# Altium schematic sheet Sensors.SchDoc
size A; SheetNumber: 4; SheetTotal: 6
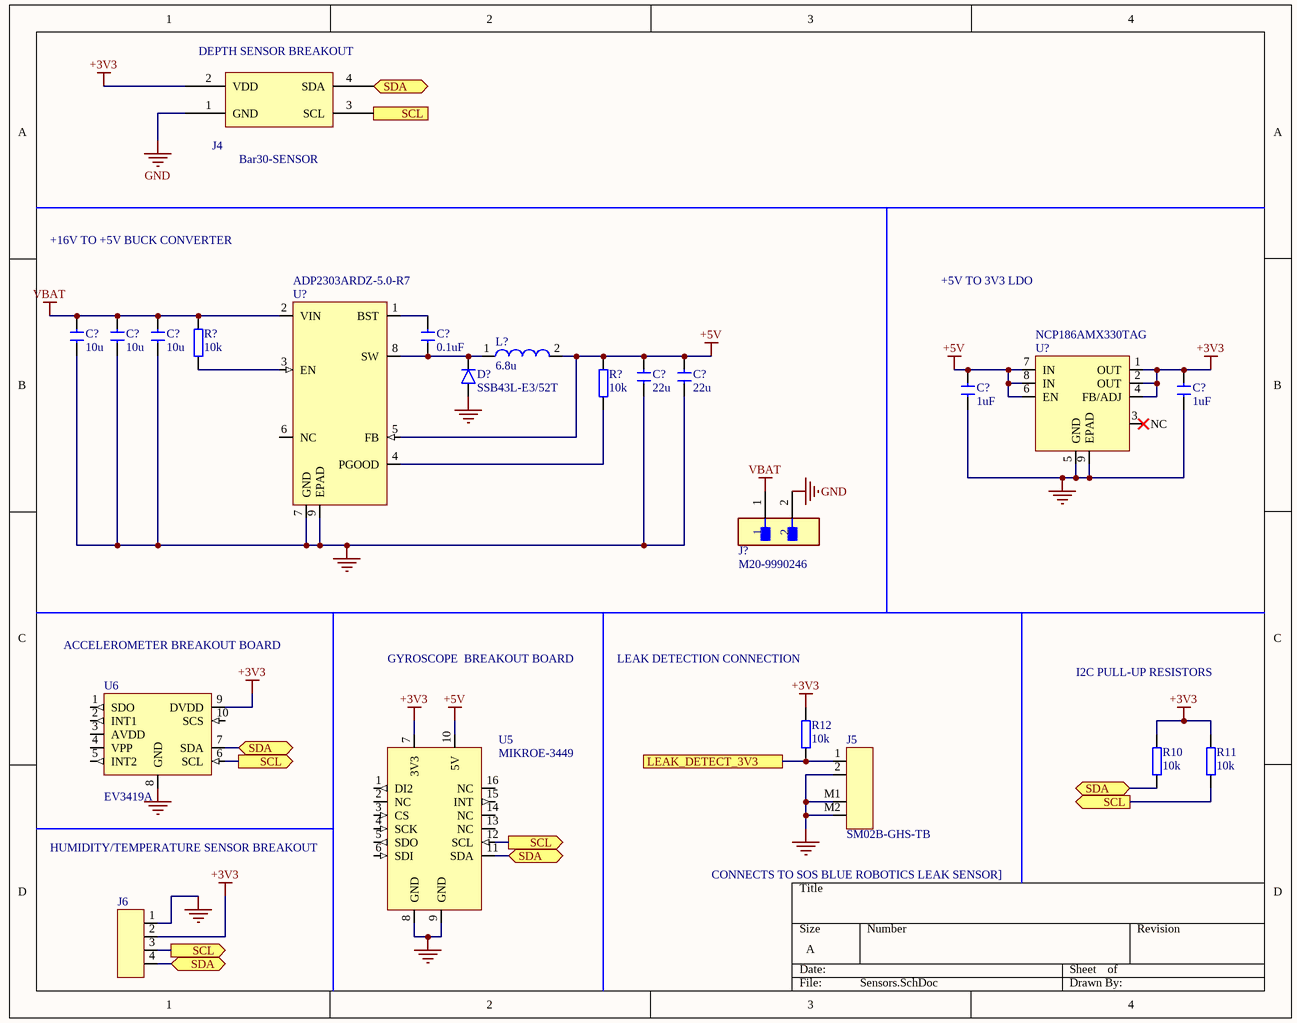
[diagram p0: Sensors.SchDoc]

## Parts
(Parts that share a designator on the sheet are numbered #1, #2 ... from top to bottom, then left to right.)
C?#1  10u  [1206 Capacitor]
C?#2  10u  [1206 Capacitor]
C?#3  10u  [1206 Capacitor]
C?#4  0.1uF  [0603 Capacitor]
C?#5  22u  [0805 Capacitor]
C?#6  22u  [0805 Capacitor]
C?#7  1uF  [0603 Capacitor]
C?#8  1uF  [0603 Capacitor]
D?  SSB43L-E3/52T  [DO-214AA]
J4  Bar30-SENSOR
J5  SM02B-GHS-TB  [SM02B-GHS-TB]
J6  PPTC041LFBN-RC  [HDR 4POS 2.54mm]  (value not drawn)
J?  M20-9990246  [FP-M20-9990246-MFG]
L?  6.8u  [CLF10060NIT-6R8N-D 10.10mm x 10.00mm]
R10  10k  [0603 Resistor]
R11  10k  [0603 Resistor]
R12  10k  [0603 Resistor]
R?#1  10k  [0603 Resistor]
R?#2  10k  [0603 Resistor]
U5  MIKROE-3449  [MIKROE-3449]
U6  EV3419A  [EV3419A]
U?#1  ADP2303ARDZ-5.0-R7  [SOIC-8-EP]
U?#2  NCP186AMX330TAG  [8-XFDFN Exposed Pad]

## Ports
LEAK_DETECT_3V3 (see Microcontroller[3E], Microcontroller[9B]), SCL (out, see Microcontroller[1D], Microcontroller[2E], Microcontroller[4D], Microcontroller[5D], Microcontroller[5E], Microcontroller[9E], Sensors[1C], Sensors[1D], Sensors[2A], Sensors[2D]), SCL (out, see Microcontroller[1D], Microcontroller[2E], Microcontroller[4D], Microcontroller[5D], Microcontroller[5E], Microcontroller[9E], Sensors[1C], Sensors[1D], Sensors[2A], Sensors[4D]), SCL (out, see Microcontroller[1D], Microcontroller[2E], Microcontroller[4D], Microcontroller[5D], Microcontroller[5E], Microcontroller[9E], Sensors[1C], Sensors[1D], Sensors[2D], Sensors[4D]), SCL (out, see Microcontroller[1D], Microcontroller[2E], Microcontroller[4D], Microcontroller[5D], Microcontroller[5E], Microcontroller[9E], Sensors[1C], Sensors[2A], Sensors[2D], Sensors[4D]), SCL (out, see Microcontroller[1D], Microcontroller[2E], Microcontroller[4D], Microcontroller[5D], Microcontroller[5E], Microcontroller[9E], Sensors[1D], Sensors[2A], Sensors[2D], Sensors[4D]), SDA (bidir, see Microcontroller[1D], Microcontroller[2E], Microcontroller[4D], Microcontroller[5D], Microcontroller[5E], Microcontroller[9E], Sensors[1C], Sensors[1D], Sensors[2A], Sensors[2D]), SDA (bidir, see Microcontroller[1D], Microcontroller[2E], Microcontroller[4D], Microcontroller[5D], Microcontroller[5E], Microcontroller[9E], Sensors[1C], Sensors[1D], Sensors[2A], Sensors[4D]), SDA (bidir, see Microcontroller[1D], Microcontroller[2E], Microcontroller[4D], Microcontroller[5D], Microcontroller[5E], Microcontroller[9E], Sensors[1C], Sensors[1D], Sensors[2D], Sensors[4D]), SDA (bidir, see Microcontroller[1D], Microcontroller[2E], Microcontroller[4D], Microcontroller[5D], Microcontroller[5E], Microcontroller[9E], Sensors[1C], Sensors[2A], Sensors[2D], Sensors[4D]), SDA (bidir, see Microcontroller[1D], Microcontroller[2E], Microcontroller[4D], Microcontroller[5D], Microcontroller[5E], Microcontroller[9E], Sensors[1D], Sensors[2A], Sensors[2D], Sensors[4D])

## Nets
+3V3: C?#8.1 J4.2(VDD) J6.2 R10.2 R11.2 R12.2 U5.7(3V3) U6.9(DVDD) U?#2.1(OUT) U?#2.2(OUT) U?#2.4(FB/ADJ)
+5V: C?#5.1 C?#6.1 C?#7.1 L?.2 R?#2.1 U5.10(5V) U?#1.5(FB) U?#2.6(EN) U?#2.7(IN) U?#2.8(IN)
GND: C?#1.1 C?#2.1 C?#3.1 C?#5.2 C?#6.2 C?#7.2 C?#8.2 D?.A J4.1(GND) J5.2 J5.M1 J5.M2 J6.1 J?.2 U5.8(GND) U5.9(GND) U6.8(GND) U?#1.7(GND) U?#1.9(EPAD) U?#2.5(GND) U?#2.9(EPAD)
VBAT: C?#1.2 C?#2.2 C?#3.2 J?.1 R?#1.1 U?#1.2(VIN)
LEAK_DETECT_3V3: J5.1 R12.1 ; port LEAK_DETECT_3V3
SCL: J4.3(SCL) J6.3 R11.1 U5.12(SCL) U6.6(SCL) ; port SCL
SDA: J4.4(SDA) J6.4 R10.1 U5.11(SDA) U6.7(SDA) ; port SDA
NetC?#4_1: C?#4.1 D?.C L?.1 U?#1.8(SW)
NetC?#4_2: C?#4.2 U?#1.1(BST)
NetR?#1_2: R?#1.2 U?#1.3(EN)
NetR?#2_2: R?#2.2 U?#1.4(PGOOD)

Not connected (* = marked no-connect by the designer): U5 1(DI2) 2(NC) 3(CS) 4(SCK) 5(SDO) 6(SDI) 13(NC) 14(NC) 15(INT) 16(NC); U6 1(SDO) 2(INT1) 3(AVDD) 4(VPP) 5(INT2) 10(SCS); U?#1 6(NC); U?#2 3(NC)

## Notes on the sheet
- (near J4) DEPTH SENSOR BREAKOUT
- +16V TO +5V BUCK CONVERTER
- +5V TO 3V3 LDO
- ACCELEROMETER BREAKOUT BOARD
- GYROSCOPE  BREAKOUT BOARD
- LEAK DETECTION CONNECTION
- I2C PULL-UP RESISTORS
- HUMIDITY/TEMPERATURE SENSOR BREAKOUT
- CONNECTS TO SOS BLUE ROBOTICS LEAK SENSOR]

## Library data of the parts
C?#1-C?#3 = GRM31CR71E106MA12L: CAP CER 10UF 25V X7R 1206; Manufacturer: Murata; Material: 4241ConductorMaterial; Tolerance: 20%; Supplier: Digi-Key; Supplier Part Number: 490-6519-1-ND; Manufacturer Part Number: GRM31CR71E106MA12L; RoHS: Yes; Category: Ceramic Capacitors; Stock: 74067; Pricing: 1=0.29, 10=0.199, 50=0.1396, 100=0.1196, 500=0.08972, 1000=0.07576 (USD); Mounting Technology: Surface Mount; Case/Package: 1206; Case Code (Metric): 3216; Case Code (Imperial): 1206; Min Operating Temperature: -55°C; Max Operating Temperature: 125°C; Value: 10uF; Dielectric: X7R; Package Quantity: 1; Voltage Rating: 25V; Packaging: Tape and Reel; Termination: SMD/SMT; Voltage: 25V; Voltage Rating (DC): 25V; Series: GRM; Construction: Flat; Length: 3.2mm; Width: 0.063inch; Height: 1.6mm; Thickness: 0.071inch; Depth: 1.6mm; Radiation Hardening: No; Reach SVHC Compliant: No; Lead Free: Lead Free; RoHS Compliant: Yes; ComponentLink1URL: https://datasheet.ciiva.com/11607/product-11607561.pdf?src-supplier=Avnet; ComponentLink1Description: https://datasheet.ciiva.com/11607/product-11607561.pdf?src-supplier=Avnet; ComponentLink2URL: https://datasheet.ciiva.com/5412/product-5412861.pdf?src-supplier=Mouser; ComponentLink2Description: https://datasheet.ciiva.com/5412/product-5412861.pdf?src-supplier=Mouser; ComponentLink3URL: https://datasheet.ciiva.com/6264/partnumbering-e-01-6264463.pdf?src-supplier=Digi-Key; ComponentLink3Description: https://datasheet.ciiva.com/6264/partnumbering-e-01-6264463.pdf?src-supplier=Digi-Key
C?#4 = CC0603KRX7R9BB104: CAP CER 0.1UF 50V X7R 0603; Manufacturer: Yageo; Dielectric Material: Ceramic; Value: 100nF; Tolerance: 10%; Supplier: Digi-Key; Supplier Part Number: 311-1344-1-ND; Manufacturer Part Number: CC0603KRX7R9BB104; RoHS: Yes; Category: Ceramic Capacitors; Stock: 4893723; Pricing: 1=0.1, 10=0.054, 50=0.0296, 100=0.0243, 500=0.01732, 1000=0.01361 (USD); Mounting Technology: Surface Mount; Case/Package: 0603; Pins: 2; Case Code (Metric): 1608; Case Code (Imperial): 0603; Min Operating Temperature: -55°C; Max Operating Temperature: 125°C; Package Quantity: 1; Voltage Rating: 50V; Packaging: Tape and Reel; Dielectric: X7R; Termination: SMD/SMT; Voltage: 50V; Series: CC; Length: 0.063inch; Width: 0.031inch; Height: 0.8mm; Thickness: 0.035inch; Depth: 0.8mm; Radiation Hardening: No; Reach SVHC Compliant: No; Lead Free: Lead Free; Halogen Free: Halogen Free; RoHS Compliant: Yes; ComponentLink1URL: https://datasheet.ciiva.com/11786/0900766b80d84f1d-11786061.pdf?src-supplier=Rs; ComponentLink1Description: https://datasheet.ciiva.com/11786/0900766b80d84f1d-11786061.pdf?src-supplier=Rs; ComponentLink2URL: https://datasheet.ciiva.com/8033/70765-8033819.pdf?src-supplier=Element14; ComponentLink2Description: https://datasheet.ciiva.com/8033/70765-8033819.pdf?src-supplier=Element14; ComponentLink3URL: https://datasheet.ciiva.com/8033/70765-8033821.pdf?src-supplier=Element14; ComponentLink3Description: https://datasheet.ciiva.com/8033/70765-8033821.pdf?src-supplier=Element14; ComponentLink4URL: https://datasheet.ciiva.com/7978/1489800-7978166.pdf?src-supplier=Element14; ComponentLink4Description: https://datasheet.ciiva.com/7978/1489800-7978166.pdf?src-supplier=Element14; ComponentLink5URL: https://datasheet.ciiva.com/31394/1489800-31394927.pdf?src-supplier=Farnell; ComponentLink5Description: https://datasheet.ciiva.com/31394/1489800-31394927.pdf?src-supplier=Farnell; ComponentLink6URL: https://datasheet.ciiva.com/22749/1489800-22749214.pdf?src-supplier=Element14; ComponentLink6Description: https://datasheet.ciiva.com/22749/1489800-22749214.pdf?src-supplier=Element14; ComponentLink7URL: https://datasheet.ciiva.com/144/mlccorderingcode-144177.pdf?src-supplier=Digi-Key; ComponentLink7Description: https://datasheet.ciiva.com/144/mlccorderingcode-144177.pdf?src-supplier=Digi-Key; ComponentLink8URL: https://datasheet.ciiva.com/144/mlccorderingcode-144176.pdf?src-supplier=Digi-Key; ComponentLink8Description: https://datasheet.ciiva.com/144/mlccorderingcode-144176.pdf?src-supplier=Digi-Key; ComponentLink9URL: https://datasheet.ciiva.com/144/mlccorderingcode-144178.pdf?src-supplier=Digi-Key; ComponentLink9Description: https://datasheet.ciiva.com/144/mlccorderingcode-144178.pdf?src-supplier=Digi-Key
C?#5 C?#6 = GRM21BZ71A226ME15L: CAP CER 22UF 10V X7R 0805; Manufacturer: Murata; Supplier: Digi-Key; Supplier Part Number: 490-GRM21BZ71A226ME15LCT-ND; Manufacturer Part Number: GRM21BZ71A226ME15L; RoHS: Yes; Category: Ceramic Capacitors; Stock: 55376; Pricing: 1=0.35, 10=0.241, 50=0.1688, 100=0.1447, 500=0.10852, 1000=0.09164 (USD); RoHS Compliant: Yes; ComponentLink1URL: https://datasheet.octopart.com/GRM21BZ71A226ME15L-Murata-datasheet-165579666.pdf?src-supplier=TME; ComponentLink1Description: https://datasheet.octopart.com/GRM21BZ71A226ME15L-Murata-datasheet-165579666.pdf?src-supplier=TME
C?#7 C?#8 = CL10A105KB8NNNC: CAP CER 1UF 50V X5R 0603; Manufacturer: Samsung; Tolerance: 10%; Supplier: Digi-Key; Supplier Part Number: 1276-1860-1-ND; Manufacturer Part Number: CL10A105KB8NNNC; RoHS: Yes; Category: Ceramic Capacitors; Stock: 3695273; Pricing: 1=0.14, 10=0.098, 50=0.0558, 100=0.0462, 500=0.03238, 1000=0.0268 (USD); Mounting Technology: Surface Mount; Case/Package: 0603; Case Code (Metric): 1608; Case Code (Imperial): 0603; Min Operating Temperature: -55°C; Max Operating Temperature: 85°C; Packaging: Tape and Reel; Value: 1uF; Voltage Rating: 50V; Dielectric: X5R; Series: CL; Length: 1.6mm; Depth: 0.8mm; Radiation Hardening: No; RoHS Compliant: Yes; ComponentLink1URL: https://datasheet.ciiva.com/26877/getdatasheetpartid-753736-26877879.pdf?src-supplier=Verical; ComponentLink1Description: https://datasheet.ciiva.com/26877/getdatasheetpartid-753736-26877879.pdf?src-supplier=Verical
D? = SSB43L-E3/52T: DIODE SCHOTTKY 30V 4A DO214AA; Manufacturer: Vishay Semiconductors; Max Surge Current: 100A; Forward Voltage: 450mV; Max Reverse Current: 600uA; Polarity: Standard; Supplier: Digi-Key; Supplier Part Number: SSB43L-E3/52TGICT-ND; Manufacturer Part Number: SSB43L-E3/52T; RoHS: Yes; Category: Rectifier Diodes; Stock: 42896; Pricing: 1=0.56, 10=0.482, 100=0.3351 (USD); Mounting Technology: Surface Mount; Case/Package: DO-214AA; Pins: 2; Min Operating Temperature: -65°C; Max Operating Temperature: 150°C; Packaging: Tape and Reel; Forward Current: 4A; Package Quantity: 1; Max Reverse Leakage Current: 600uA; Average Rectified Current: 4A; Peak Non-Repetitive Surge Current: 100A; Max Repetitive Reverse Voltage (Vrrm): 30V; Max Forward Surge Current (Ifsm): 100A; Voltage Rating (DC): 30V; Current Rating: 4A; Output Current: 4A; Max Reverse Voltage (DC): 30V; Length: 4.7mm; Width: 3.8mm; Height: 0.095inch; Radiation Hardening: No; Lead Free: Lead Free; RoHS Compliant: Yes; Reach SVHC Compliant: Unknown; ComponentLink1URL: https://datasheet.ciiva.com/14634/0900766b80dd0508-14634162.pdf?src-supplier=Allied+Electronics; ComponentLink1Description: https://datasheet.ciiva.com/14634/0900766b80dd0508-14634162.pdf?src-supplier=Allied+Electronics; ComponentLink2URL: https://datasheet.ciiva.com/4245/ssb43l-4245635.pdf?src-supplier=Arrow+Electronics; ComponentLink2Description: https://datasheet.ciiva.com/4245/ssb43l-4245635.pdf?src-supplier=Arrow+Electronics; ComponentLink3URL: https://datasheet.ciiva.com/18434/70217334-18434422.pdf?src-supplier=Allied+Electronics; ComponentLink3Description: https://datasheet.ciiva.com/18434/70217334-18434422.pdf?src-supplier=Allied+Electronics
J5 = SM02B-GHS-TB: CONN HDR PIN; Manufacturer: JST; Supplier: Digikey; Supplier Part Number: 455-1564-1-ND; Manufacturer Part Number: SM02B-GHS-TB; RoHS: No; Stock: 9689; Pricing: 1=0.46, 10=0.39, 100=0.303, 500=0.2597, 1000=0.21642 (USD)
J6 = PPTC041LFBN-RC: CONN HDR 4POS 0.1 TIN PCB; Manufacturer: Sullins; Number of Positions: 4; Connector Type: Header; Voltage Rating: 250V; Pitch: 2.54mm; Supplier: Digikey; Supplier Part Number: S7002-ND; Manufacturer Part Number: PPTC041LFBN-RC; RoHS: Yes; Category: Connectors; Stock: 28323; Pricing: 1=0.46, 10=0.399, 100=0.3286, 500=0.28574, 1000=0.23574, 5000=0.20716, 10000=0.2041 (USD); Mounting Technology: Through Hole; Contact Material: Bronze; Housing Material: Plastic; Contact Finish - Mating: TIN; Insulation Color: Black; Insulation Material: Polyester; Contact Shape: Square; Min Operating Temperature: -40°C; Max Operating Temperature: 105°C; Number of Rows: 1; Packaging: Tray; Termination: Solder; Contact Type: Female Socket; Fastening Type: Pull; Series: -; Length: 10.7mm; Width: 2.5mm; Height: 8.5mm; Lead Free: Lead Free; RoHS Compliant: Yes; Flammability Rating: UL94 V-0; ComponentLink1URL: https://media.digikey.com/pdf/Data%20Sheets/Sullins%20PDFs/Female_Headers.100_DS.pdf?src-supplier=Digikey; ComponentLink1Description: https://media.digikey.com/pdf/Data%20Sheets/Sullins%20PDFs/Female_Headers.100_DS.pdf?src-supplier=Digikey; ComponentLink2URL: http://www.sullinscorp.com/catalogs/78_Page80-81_HEADER_.100_2.54mm_FEMALE.pdf?src-supplier=Future+Electronics; ComponentLink2Description: http://www.sullinscorp.com/catalogs/78_Page80-81_HEADER_.100_2.54mm_FEMALE.pdf?src-supplier=Future+Electronics; ComponentLink3URL: https://datasheet.octopart.com/PPTC041LFBN-RC-Sullins-datasheet-41308905.pdf?src-supplier=Future+Electronics; ComponentLink3Description: https://datasheet.octopart.com/PPTC041LFBN-RC-Sullins-datasheet-41308905.pdf?src-supplier=Future+Electronics
J? = CMP-15831-000009-1: CONN HEADER VERT 2POS 2.54MM; Manufacturer: Harwin; Conn Gender: Male; Conn Orientation: Vertical; Number Of Contacts: 2; Current Rating: 3A; ComponentLink2URL: https://cdn.harwin.com/pdfs/M20-999.pdf; ComponentLink2Description: Datasheet; Package: M20-9990246; Temperature: -40°C to +105°C; Octopart: https://octopart.com/m20-9990246-harwin-2590635; Mouser Description: 2.54mm (0.1") Pitch SIL Vertical PC Tail Pin Header, 6.1mm mating pin height, tin, 2 contacts; Temperature Range High: +105°C; Device Class L1: Connectors; RoHS: TRUE; Automotive: No; Height: 8.99mm; Number Of Rows: 1; Contact Material: Tin,Nickel; Category: Conn; Pitch: 2.54mm; Lead Free: Yes; Digikey Description: CONN HEADER VERT 2POS 2.54MM; Manufacturer Part Number: M20-9990246; Temperature Range Low: -40°C; Device Class L3: unset; Device Class L2: Headers and Wire Housings
L? = CLF10060NIT-6R8N-D: FIXED IND 6.8UH 4.25A 16.9 MOHM; Manufacturer: TDK; Core Material: Ferrite; RMS Current (Irms): 6.6A; DC Resistance (DCR): 16.9mR; Inductance Tolerance: 30%; Shielding: Shielded; Test Frequency: 100kHz; Supplier: Digi-Key; Supplier Part Number: 445-174715-1-ND; Manufacturer Part Number: CLF10060NIT-6R8N-D; RoHS: Yes; Category: Fixed Inductors; Stock: 2437; Pricing: 1=1.43, 10=1.323, 25=1.1024, 50=1.0364, 100=0.9261, 250=0.7938 (USD); Mounting Technology: Surface Mount; Case/Package: Nonstandard; Min Operating Temperature: -55°C; Max Operating Temperature: 150°C; Value: 6.8uH; Saturation Current: 4.25A; Packaging: Tape and Reel; Series: CLF-NI-D; Tolerance: 30%; Ratings: AEC-Q200; Reach SVHC Compliant: No; RoHS Compliant: Yes; ComponentLink1URL: https://product.tdk.com/info/en/catalog/datasheets/inductor_automotive_power_clf10060ni-d_en.pdf?src-supplier=Digi-Key; ComponentLink1Description: https://product.tdk.com/info/en/catalog/datasheets/inductor_automotive_power_clf10060ni-d_en.pdf?src-supplier=Digi-Key; ComponentLink2URL: https://product.tdk.com/info/en/catalog/datasheets/inductor_automotive_power_clf10060ni-d_en.pdf?ref_disty=digikey&src-supplier=Digi-Key; ComponentLink2Description: https://product.tdk.com/info/en/catalog/datasheets/inductor_automotive_power_clf10060ni-d_en.pdf?ref_disty=digikey&src-supplier=Digi-Key; ComponentLink3URL: http://www.farnell.com/datasheets/2159117.pdf?src-supplier=Element14; ComponentLink3Description: http://www.farnell.com/datasheets/2159117.pdf?src-supplier=Element14
R10-R12 R?#1 R?#2 = RC0603FR-1310KL: RES 10K OHM 1% 1/10W 0603; Manufacturer: Yageo; Value: 10kR; Power Rating: 100mW; Voltage Rating: 50V; Temperature Coefficient: 100ppm/°C; Supplier: Digi-Key; Supplier Part Number: 13-RC0603FR-1310KLDKR-ND; Manufacturer Part Number: RC0603FR-1310KL; RoHS: Yes; Category: Chip SMD Resistors; Stock: 124542; Pricing: 1=0.1, 10=0.018, 50=0.0106, 100=0.0088, 500=0.00592, 1000=0.00505, 5000=0.00363, 10000=0.00318 (USD); Pins: 2; Case Code (Imperial): 0603; Case Code (Metric): 1608; Case/Package: 0603; Min Operating Temperature: -55°C; Max Operating Temperature: 155°C; Tolerance: 1%; Packaging: Tape and Reel; Resistor Type: Thick Film; Termination: SMD/SMT; Voltage Rating (DC): 50V; Series: RC; Resistance Tolerance: 1%; RoHS Compliant: Yes; Reach SVHC Compliant: No; Lead Free: Lead Free; ComponentLink1URL: https://datasheet.ciiva.com/7983/443971-7983673.pdf?src-supplier=Element14; ComponentLink1Description: https://datasheet.ciiva.com/7983/443971-7983673.pdf?src-supplier=Element14; ComponentLink2URL: https://datasheet.ciiva.com/16850/pyu-rc0603-51-rohs-l-4-16850349.pdf?src-supplier=Future+Electronics; ComponentLink2Description: https://datasheet.ciiva.com/16850/pyu-rc0603-51-rohs-l-4-16850349.pdf?src-supplier=Future+Electronics
U5 = MIKROE-3449: Gyro 3 Click I3G4250 Three-Axis Digital Gyroscope Sensor IC Add-On Board; Manufacturer: mikroElektronika; Supplier: Digi-Key; Supplier Part Number: 1471-2189-ND; Manufacturer Part Number: MIKROE-3449; RoHS: No; Stock: 1; Pricing: 1=25 (USD)
U6 = EV3419A: MC3419 DAUGHTER CARD; Manufacturer: Memsic; Supplier: Digi-Key; Supplier Part Number: 3502-EV3419A-ND; Manufacturer Part Number: EV3419A; RoHS: No; Category: Uncategorized; Stock: 42; Pricing: 1=14.51 (USD)
U?#1 = ADP2303ARDZ-5.0-R7: IC REG BUCK 5V 3A 8SOIC; Manufacturer: Analog Devices; Number of Outputs: 1; Min Input Voltage: 3V; Max Supply Voltage: 20V; Rise Time: 170ns; Switching Frequency: 700kHz; Min Output Voltage: 800mV; Synchronous Rectifier: No; Operating Supply Current: 950uA; Fall Time: 280ns; Max Duty Cycle: 50%; Max Output Voltage: 16V; Output Type: Fixed; Output Configuration: Positive; Supplier: Digi-Key; Supplier Part Number: 505-ADP2303ARDZ-5.0-R7CT-ND; Manufacturer Part Number: ADP2303ARDZ-5.0-R7; RoHS: Yes; Category: Voltage Regulators - Switching; Stock: 1579; Pricing: 1=4.1, 10=3.678, 25=3.4768, 100=3.0133, 250=2.8588, 500=2.5652 (USD); Mounting Technology: Surface Mount; Case/Package: SOIC; Pins: 8; Weight: 0.019048oz; Contact Plating: Tin,Matte; Min Operating Temperature: -40°C; Max Operating Temperature: 125°C; Packaging: Tape and Reel; Output Current: 3A; Output Voltage: 5V; Operating Supply Voltage: 20V; Nominal Output Voltage: 5V; Max Output current: 3A; Series: -; Length: 4.9mm; Width: 4mm; Height: 1.75mm; Radiation Hardening: No; Reach SVHC Compliant: No; Lead Free: Contains Lead; RoHS Compliant: Yes; ComponentLink1URL: https://datasheet.ciiva.com/25626/0900766b810b59f9-25626508.pdf?src-supplier=Rs; ComponentLink1Description: https://datasheet.ciiva.com/25626/0900766b810b59f9-25626508.pdf?src-supplier=Rs; ComponentLink2URL: https://datasheet.ciiva.com/7994/1624274-7994911.pdf?src-supplier=Element14; ComponentLink2Description: https://datasheet.ciiva.com/7994/1624274-7994911.pdf?src-supplier=Element14; ComponentLink3URL: https://datasheet.ciiva.com/28436/1624274-28436554.pdf?src-supplier=Element14; ComponentLink3Description: https://datasheet.ciiva.com/28436/1624274-28436554.pdf?src-supplier=Element14; ComponentLink4URL: https://datasheet.ciiva.com/2024/adp2302-2303-2024382.pdf?src-supplier=Digi-Key; ComponentLink4Description: https://datasheet.ciiva.com/2024/adp2302-2303-2024382.pdf?src-supplier=Digi-Key; ComponentLink5URL: https://datasheet.ciiva.com/2024/adp2302-2303-2024383.pdf?src-supplier=Digi-Key; ComponentLink5Description: https://datasheet.ciiva.com/2024/adp2302-2303-2024383.pdf?src-supplier=Digi-Key; ComponentLink6URL: https://datasheet.ciiva.com/2024/adp2302-2303-2024384.pdf?src-supplier=Digi-Key; ComponentLink6Description: https://datasheet.ciiva.com/2024/adp2302-2303-2024384.pdf?src-supplier=Digi-Key; ComponentLink7URL: https://datasheet.ciiva.com/48696/001251161-da-01-en-ic-reg-buc-adp2303ardz-5-0-r7-soic-8-adi-48696838.pdf?src-supplier=Conrad; ComponentLink7Description: https://datasheet.ciiva.com/48696/001251161-da-01-en-ic-reg-buc-adp2303ardz-5-0-r7-soic-8-adi-48696838.pdf?src-supplier=Conrad
U?#2 = NCP186AMX330TAG: ICREGLDO3.3V1A8XDFN